# EAGLE schematic MegaTemplate (EAGLE 9.2.2)
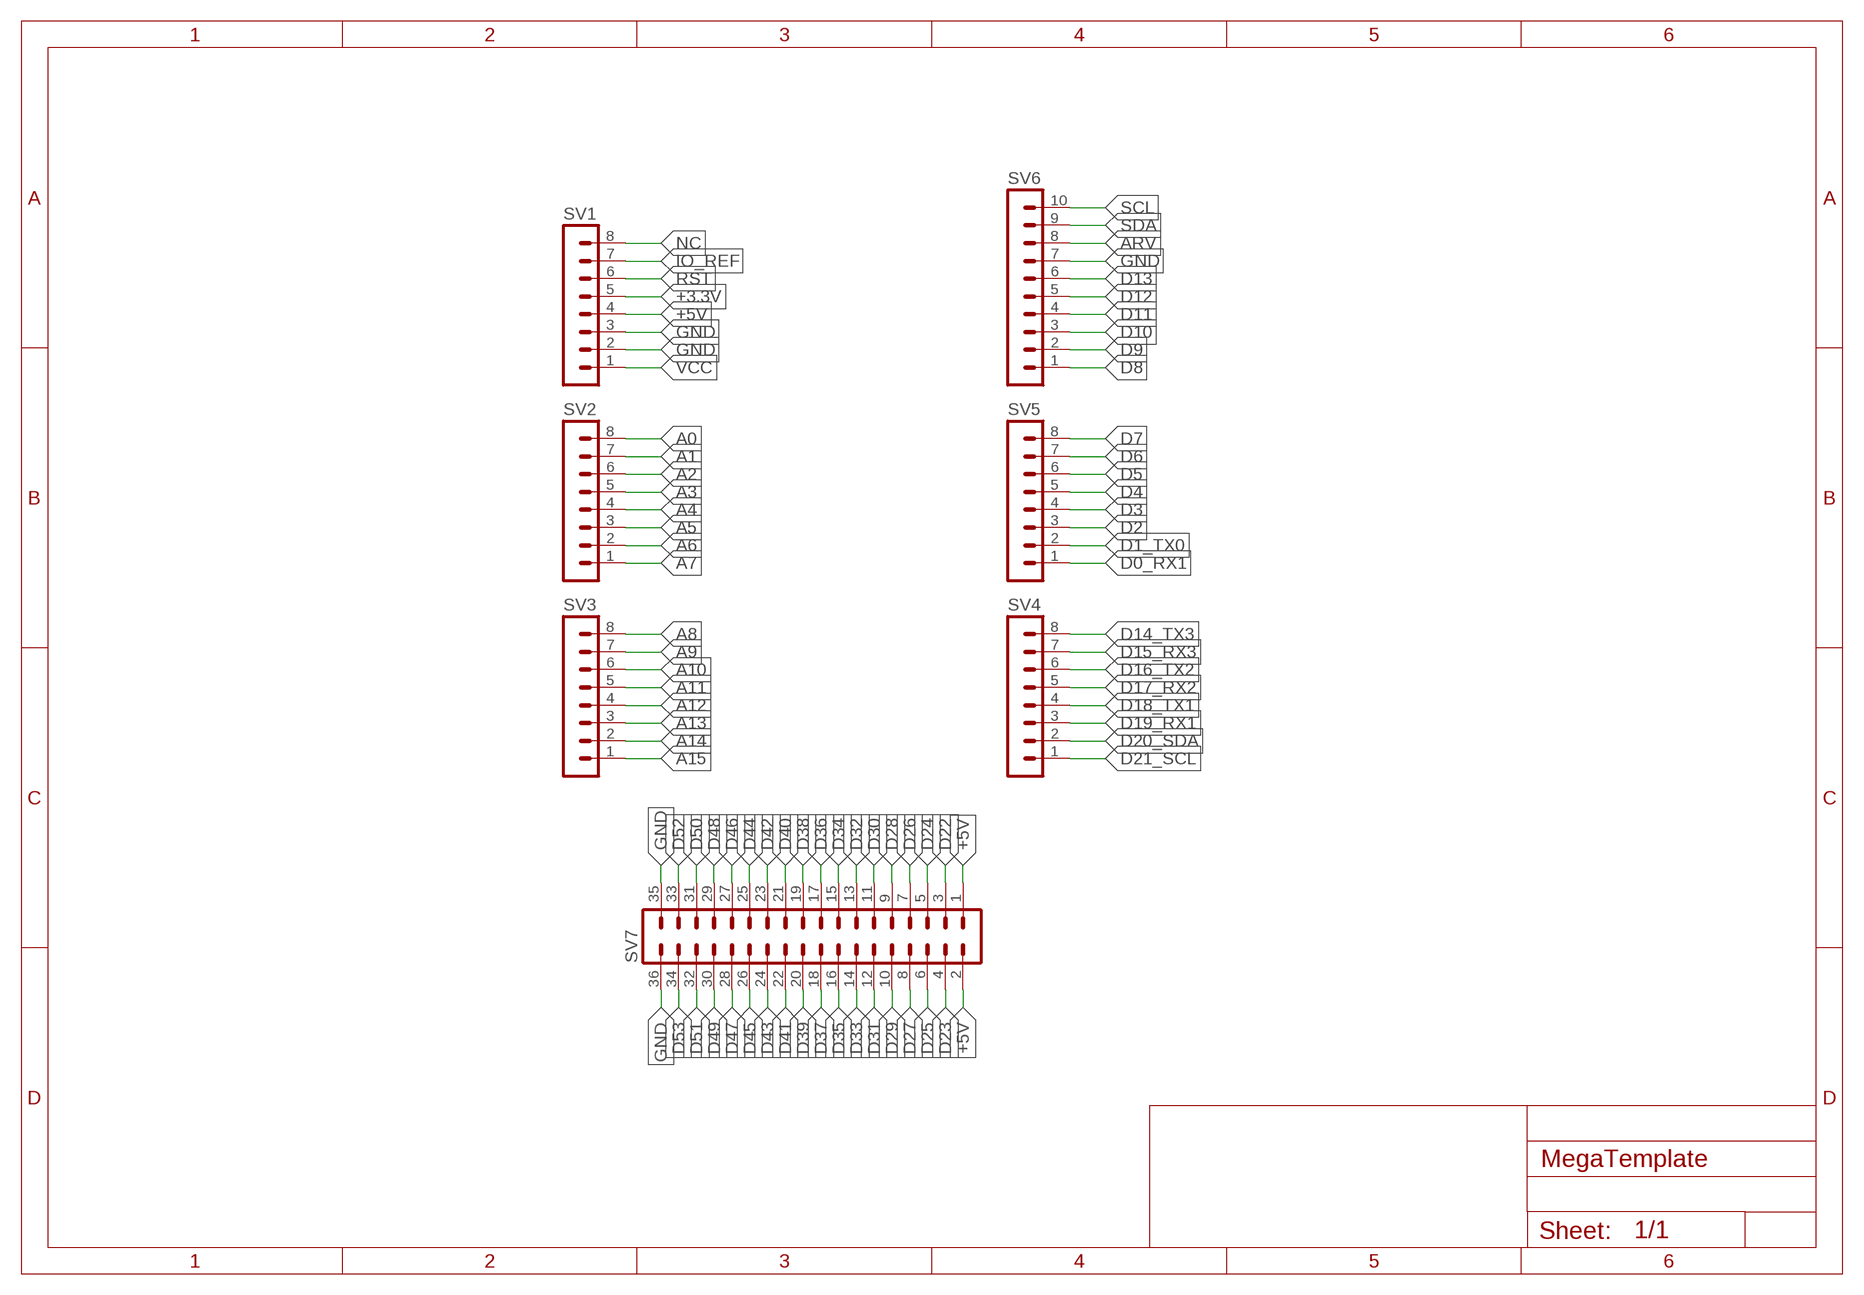
[diagram p0: schematic, sheet 1]

## Parts
SV1  MA08-1  [MA08-1]
SV2  MA08-1  [MA08-1]
SV3  MA08-1  [MA08-1]
SV4  MA08-1  [MA08-1]
SV5  MA08-1  [MA08-1]
SV6  MA10-1  [MA10-1]
SV7  MA18-2  [MA18-2]

## Nets
+3.3V: SV1.5
+5V: SV1.4 SV7.1 SV7.2
A0: SV2.8
A1: SV2.7
A2: SV2.6
A3: SV2.5
A4: SV2.4
A5: SV2.3
A6: SV2.2
A7: SV2.1
A8: SV3.8
A9: SV3.7
A10: SV3.6
A11: SV3.5
A12: SV3.4
A13: SV3.3
A14: SV3.2
A15: SV3.1
ARV: SV6.8
D0_RX1: SV5.1
D1_TX0: SV5.2
D2: SV5.3
D3: SV5.4
D4: SV5.5
D5: SV5.6
D6: SV5.7
D7: SV5.8
D8: SV6.1
D9: SV6.2
D10: SV6.3
D11: SV6.4
D12: SV6.5
D13: SV6.6
D14_TX3: SV4.8
D15_RX3: SV4.7
D16_TX2: SV4.6
D17_RX2: SV4.5
D18_TX1: SV4.4
D19_RX1: SV4.3
D20_SDA: SV4.2
D21_SCL: SV4.1
D22: SV7.3
D23: SV7.4
D24: SV7.5
D25: SV7.6
D26: SV7.7
D27: SV7.8
D28: SV7.9
D29: SV7.10
D30: SV7.11
D31: SV7.12
D32: SV7.13
D33: SV7.14
D34: SV7.15
D35: SV7.16
D36: SV7.17
D37: SV7.18
D38: SV7.19
D39: SV7.20
D40: SV7.21
D41: SV7.22
D42: SV7.23
D43: SV7.24
D44: SV7.25
D45: SV7.26
D46: SV7.27
D47: SV7.28
D48: SV7.29
D49: SV7.30
D50: SV7.31
D51: SV7.32
D52: SV7.33
D53: SV7.34
GND: SV1.2 SV1.3 SV6.7 SV7.35 SV7.36
IO_REF: SV1.7
NC: SV1.8
RST: SV1.6
SCL: SV6.10
SDA: SV6.9
VCC: SV1.1

## Library data of the parts
SV1-SV5 = con-lstb:MA08-1: PIN HEADER; OC_FARNELL: unknown; OC_NEWARK: unknown
SV6 = con-lstb:MA10-1: PIN HEADER; OC_FARNELL: unknown; OC_NEWARK: unknown
SV7 = con-lstb:MA18-2: PIN HEADER; OC_FARNELL: unknown; OC_NEWARK: unknown